# Altium schematic sheet SAMA7D65_PIO.SchDoc
size 420 x 297 mm; SheetNumber: 8; SheetTotal: 23
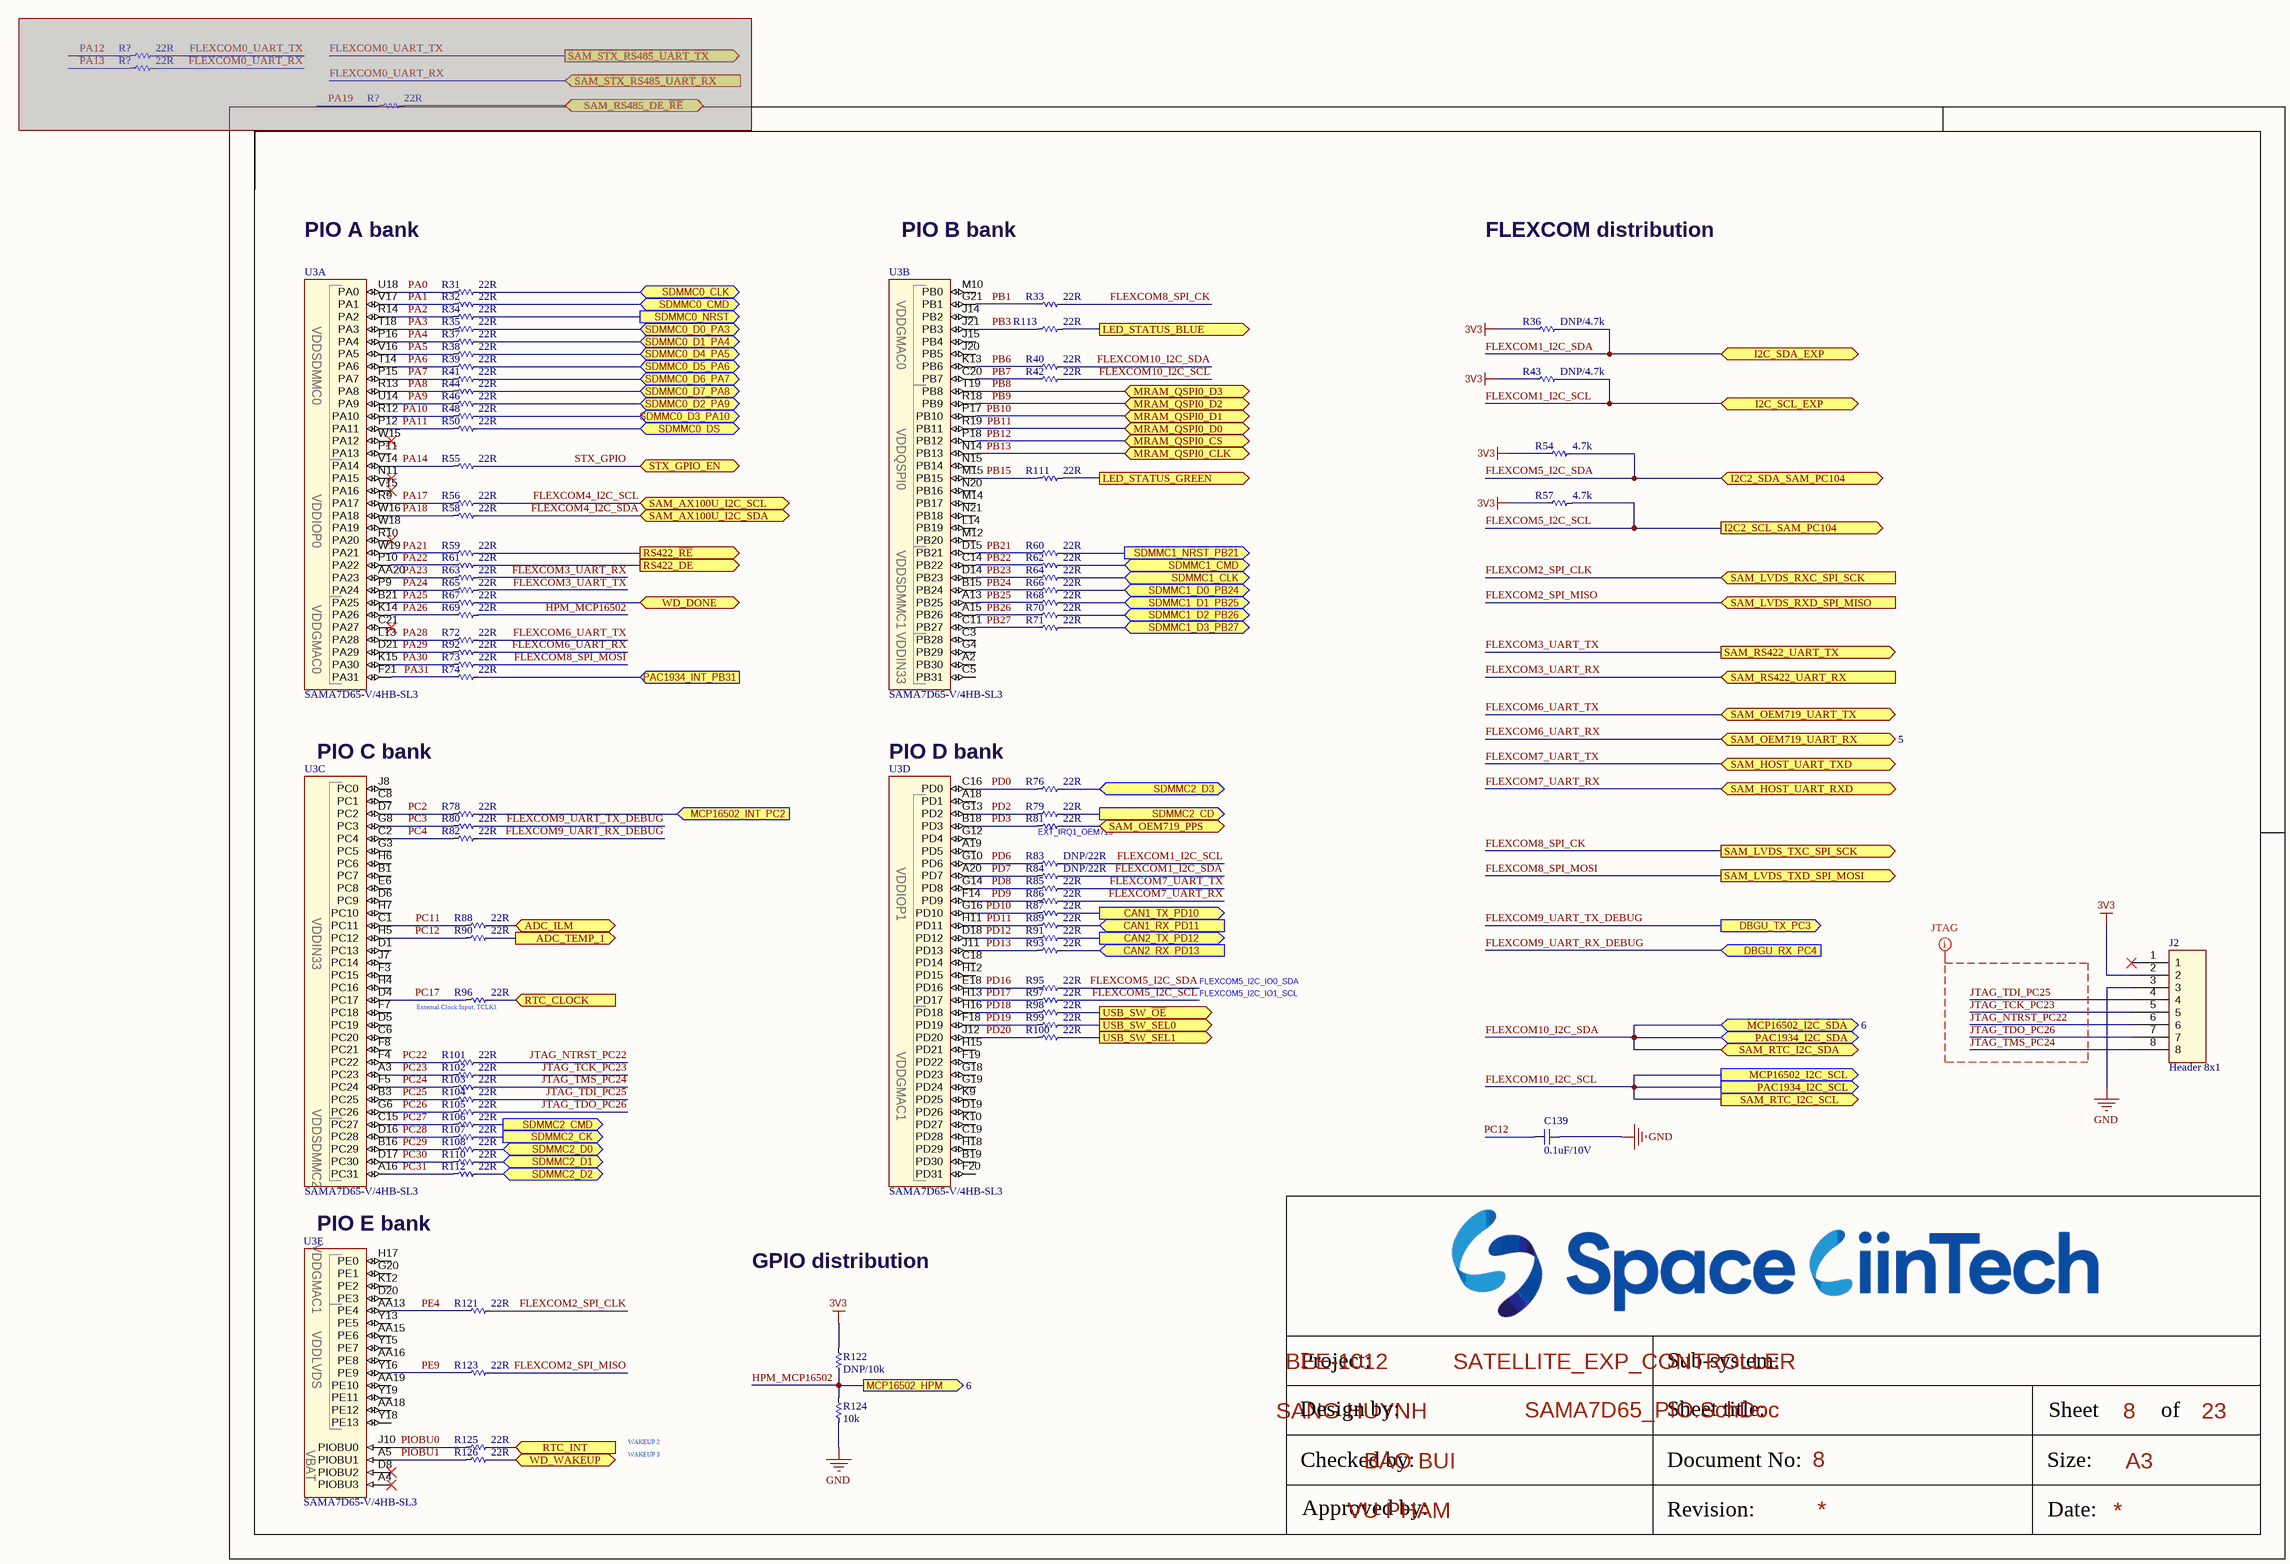
[diagram p0: SAMA7D65_PIO.SchDoc]

## Parts
(Parts that share a designator on the sheet are numbered #1, #2 ... from top to bottom, then left to right.)
C139  0.1uF/10V  [CAP_C_0603x30]
J2  Header 8x1  [Header_254P_8x1]
R31  22R  [RES_C_0603X30]
R32  22R  [RES_C_0603X30]
R33  22R  [RES_C_0603X30]
R34  22R  [RES_C_0603X30]
R35  22R  [RES_C_0603X30]
R36  DNP/4.7k  [RES_C_0603X30]
R37  22R  [RES_C_0603X30]
R38  22R  [RES_C_0603X30]
R39  22R  [RES_C_0603X30]
R40  22R  [RES_C_0603X30]
R41  22R  [RES_C_0603X30]
R42  22R  [RES_C_0603X30]
R43  DNP/4.7k  [RES_C_0603X30]
R44  22R  [RES_C_0603X30]
R46  22R  [RES_C_0603X30]
R48  22R  [RES_C_0603X30]
R50  22R  [RES_C_0603X30]
R54  4.7k  [RES_C_0603X30]
R55  22R  [RES_C_0603X30]
R56  22R  [RES_C_0603X30]
R57  4.7k  [RES_C_0603X30]
R58  22R  [RES_C_0603X30]
R59  22R  [RES_C_0603X30]
R60  22R  [RES_C_0603X30]
R61  22R  [RES_C_0603X30]
R62  22R  [RES_C_0603X30]
R63  22R  [RES_C_0603X30]
R64  22R  [RES_C_0603X30]
R65  22R  [RES_C_0603X30]
R66  22R  [RES_C_0603X30]
R67  22R  [RES_C_0603X30]
R68  22R  [RES_C_0603X30]
R69  22R  [RES_C_0603X30]
R70  22R  [RES_C_0603X30]
R71  22R  [RES_C_0603X30]
R72  22R  [RES_C_0603X30]
R73  22R  [RES_C_0603X30]
R74  22R  [RES_C_0603X30]
R76  22R  [RES_C_0603X30]
R78  22R  [RES_C_0603X30]
R79  22R  [RES_C_0603X30]
R80  22R  [RES_C_0603X30]
R81  22R  [RES_C_0603X30]
R82  22R  [RES_C_0603X30]
R83  DNP/22R  [RES_C_0603X30]
R84  DNP/22R  [RES_C_0603X30]
R85  22R  [RES_C_0603X30]
R86  22R  [RES_C_0603X30]
R87  22R  [RES_C_0603X30]
R88  22R  [RES_C_0603X30]
R89  22R  [RES_C_0603X30]
R90  22R  [RES_C_0603X30]
R91  22R  [RES_C_0603X30]
R92  22R  [RES_C_0603X30]
R93  22R  [RES_C_0603X30]
R95  22R  [RES_C_0603X30]
R96  22R  [RES_C_0603X30]
R97  22R  [RES_C_0603X30]
R98  22R  [RES_C_0603X30]
R99  22R  [RES_C_0603X30]
R100  22R  [RES_C_0603X30]
R101  22R  [RES_C_0603X30]
R102  22R  [RES_C_0603X30]
R103  22R  [RES_C_0603X30]
R104  22R  [RES_C_0603X30]
R105  22R  [RES_C_0603X30]
R106  22R  [RES_C_0603X30]
R107  22R  [RES_C_0603X30]
R108  22R  [RES_C_0603X30]
R110  22R  [RES_C_0603X30]
R111  22R  [RES_C_0603X30]
R112  22R  [RES_C_0603X30]
R113  22R  [RES_C_0603X30]
R121  22R  [RES_C_0603X30]
R122  DNP/10k  [RES_C_1005x30_L]
R123  22R  [RES_C_0603X30]
R124  10k  [RES_C_1005x30_L]
R125  22R  [RES_C_0603X30]
R126  22R  [RES_C_0603X30]
R?#1  22R  [RES_C_0603X30]  (masked out: inside a compile mask, not in the netlist)
R?#2  22R  [RES_C_0603X30]  (masked out: inside a compile mask, not in the netlist)
R?#3  22R  [RES_C_0603X30]  (masked out: inside a compile mask, not in the netlist)
U3  value SAMA7D65-V/4HB-SL3  [TFBGA-343_14x14]  (hidden comment: SAMA7D65)  (parts A,B,C,D,E of 8)

## Ports
ADC_ILM (bidir, see 3), ADC_TEMP_1 (out, see 15), CAN1_RX_PD11 (in, see 19), CAN1_TX_PD10 (out, see 19), CAN2_RX_PD13 (in, see 19), CAN2_TX_PD12 (out, see 19), DBGU_RX_PC4 (in, see 14), DBGU_TX_PC3 (out, see 14), I2C2_SCL_SAM_PC104 (out, see 5), I2C2_SDA_SAM_PC104 (bidir, see 5), I2C_SCL_EXP (bidir, see 4, 5), I2C_SDA_EXP (bidir, see 4, 5), LED_STATUS_BLUE (out, see 22), LED_STATUS_GREEN (out, see 22), MCP16502_HPM (out, see 6), MCP16502_I2C_SCL (out, see 6), MCP16502_I2C_SDA (bidir, see 6), MCP16502_INT_PC2 (in, see 6), MRAM_QSPI0_CLK (bidir, see 12), MRAM_QSPI0_CS (bidir, see 12), MRAM_QSPI0_D0 (bidir, see 12), MRAM_QSPI0_D1 (bidir, see 12), MRAM_QSPI0_D2 (bidir, see 12), MRAM_QSPI0_D3 (bidir, see 12), PAC1934_I2C_SCL (out, see 6), PAC1934_I2C_SDA (bidir, see 6), PAC1934_INT_PB31 (in, see 6), RS422_DE (out, see 21), RS422_~{RE} (out, see 21), RTC_CLOCK (in, see 16), RTC_INT (in, see 16), SAM_AX100U_I2C_SCL (bidir, see 5), SAM_AX100U_I2C_SDA (bidir, see 5), SAM_HOST_UART_RXD (bidir, see 5), SAM_HOST_UART_TXD (bidir, see 5), SAM_LVDS_RXC_SPI_SCK (in, see 18), SAM_LVDS_RXD_SPI_MISO (in, see 18), SAM_LVDS_TXC_SPI_SCK (out, see 18), SAM_LVDS_TXD_SPI_MOSI (out, see 18), SAM_OEM719_PPS (bidir, see 5), SAM_OEM719_UART_RX (bidir, see 5), SAM_OEM719_UART_TX (bidir, see 5), SAM_RS422_UART_RX (in, see 21), SAM_RS422_UART_TX (out, see 21), SAM_RS485_DE_~{RE} (bidir), SAM_RTC_I2C_SCL (out, see 16), SAM_RTC_I2C_SDA (bidir, see 16), SAM_STX_RS485_UART_RX (in), SAM_STX_RS485_UART_TX (out), SDMMC0_CLK (bidir, see 11), SDMMC0_CMD (bidir, see 11), SDMMC0_D0_PA3 (bidir, see 11), SDMMC0_D1_PA4 (bidir, see 11), SDMMC0_D2_PA9 (bidir, see 11), SDMMC0_D3_PA10 (bidir, see 11), SDMMC0_D4_PA5 (bidir, see 11), SDMMC0_D5_PA6 (bidir, see 11), SDMMC0_D6_PA7 (bidir, see 11), SDMMC0_D7_PA8 (bidir, see 11), SDMMC0_DS (bidir, see 11), SDMMC0_NRST (out, see 11), SDMMC1_CLK (bidir, see 11), SDMMC1_CMD (bidir, see 11), SDMMC1_D0_PB24 (bidir, see 11), SDMMC1_D1_PB25 (bidir, see 11), SDMMC1_D2_PB26 (bidir, see 11), SDMMC1_D3_PB27 (bidir, see 11), SDMMC1_NRST_PB21 (out, see 11), SDMMC2_CD (out, see 10), SDMMC2_CK (out, see 10), SDMMC2_CMD (out, see 10), SDMMC2_D0 (bidir, see 10), SDMMC2_D1 (bidir, see 10), SDMMC2_D2 (bidir, see 10), SDMMC2_D3 (bidir, see 10), STX_GPIO_EN (bidir, see 5), USB_SW_SEL0 (out, see 13), USB_SW_SEL1 (out, see 13), USB_SW_~{OE} (out, see 13), WD_DONE (bidir, see 17), WD_WAKEUP (bidir, see 17)

## Nets
3V3: J2.2 R36.1 R43.1 R54.1 R57.1 R122.1
GND: C139.1 J2.3 R124.2
ADC_ILM: R88.2 ; port ADC_ILM
ADC_TEMP_1: R90.2 ; port ADC_TEMP_1
CAN1_RX_PD11: R89.2 ; port CAN1_RX_PD11
CAN1_TX_PD10: R87.2 ; port CAN1_TX_PD10
CAN2_RX_PD13: R93.2 ; port CAN2_RX_PD13
CAN2_TX_PD12: R91.2 ; port CAN2_TX_PD12
FLEXCOM1_I2C_SCL: R43.2 R83.2 ; port I2C_SCL_EXP
FLEXCOM1_I2C_SDA: R36.2 R84.2 ; port I2C_SDA_EXP
FLEXCOM2_SPI_CLK: R121.2 ; port SAM_LVDS_RXC_SPI_SCK
FLEXCOM2_SPI_MISO: R123.2 ; port SAM_LVDS_RXD_SPI_MISO
FLEXCOM3_UART_RX: R63.2 ; port SAM_RS422_UART_RX
FLEXCOM3_UART_TX: R65.2 ; port SAM_RS422_UART_TX
FLEXCOM4_I2C_SCL: R56.2 ; port SAM_AX100U_I2C_SCL
FLEXCOM4_I2C_SDA: R58.2 ; port SAM_AX100U_I2C_SDA
FLEXCOM5_I2C_SCL: R57.2 R97.2 ; port I2C2_SCL_SAM_PC104
FLEXCOM5_I2C_SDA: R54.2 R95.2 ; port I2C2_SDA_SAM_PC104
FLEXCOM6_UART_RX: R92.2 ; port SAM_OEM719_UART_RX
FLEXCOM6_UART_TX: R72.2 ; port SAM_OEM719_UART_TX
FLEXCOM7_UART_RX: R86.2 ; port SAM_HOST_UART_RXD
FLEXCOM7_UART_TX: R85.2 ; port SAM_HOST_UART_TXD
FLEXCOM8_SPI_CK: R33.2 ; port SAM_LVDS_TXC_SPI_SCK
FLEXCOM8_SPI_MOSI: R73.2 ; port SAM_LVDS_TXD_SPI_MOSI
FLEXCOM9_UART_RX_DEBUG: R82.2 ; port DBGU_RX_PC4
FLEXCOM9_UART_TX_DEBUG: R80.2 ; port DBGU_TX_PC3
FLEXCOM10_I2C_SCL: R42.2 ; port MCP16502_I2C_SCL, port PAC1934_I2C_SCL, port SAM_RTC_I2C_SCL
FLEXCOM10_I2C_SDA: R40.2 ; port MCP16502_I2C_SDA, port PAC1934_I2C_SDA, port SAM_RTC_I2C_SDA
HPM_MCP16502: R69.2 R122.2 R124.1 ; port MCP16502_HPM
JTAG_NTRST_PC22: J2.6 R101.2
JTAG_TCK_PC23: J2.5 R102.2
JTAG_TDI_PC25: J2.4 R104.2
JTAG_TDO_PC26: J2.7 R105.2
JTAG_TMS_PC24: J2.8 R103.2
LED_STATUS_BLUE: R113.2 ; port LED_STATUS_BLUE
LED_STATUS_GREEN: R111.2 ; port LED_STATUS_GREEN
MCP16502_INT_PC2: R78.2 ; port MCP16502_INT_PC2
PA0: R31.1 U3.U18(PA0)
PA1: R32.1 U3.V17(PA1)
PA2: R34.1 U3.R14(PA2)
PA3: R35.1 U3.T18(PA3)
PA4: R37.1 U3.P16(PA4)
PA5: R38.1 U3.V16(PA5)
PA6: R39.1 U3.T14(PA6)
PA7: R41.1 U3.P15(PA7)
PA8: R44.1 U3.R13(PA8)
PA9: R46.1 U3.U14(PA9)
PA10: R48.1 U3.R12(PA10)
PA11: R50.1 U3.P12(PA11)
PA14: R55.1 U3.V14(PA14)
PA17: R56.1 U3.R9(PA17)
PA18: R58.1 U3.W16(PA18)
PA21: R59.1 U3.W19(PA21)
PA22: R61.1 U3.P10(PA22)
PA23: R63.1 U3.AA20(PA23)
PA24: R65.1 U3.P9(PA24)
PA25: R67.1 U3.B21(PA25)
PA26: R69.1 U3.K14(PA26)
PA28: R72.1 U3.L13(PA28)
PA29: R92.1 U3.D21(PA29)
PA30: R73.1 U3.K15(PA30)
PA31: R74.1 U3.F21(PA31)
PAC1934_INT_PB31: R74.2 ; port PAC1934_INT_PB31
PB1: R33.1 U3.G21(PB1)
PB3: R113.1 U3.J21(PB3)
PB6: R40.1 U3.K13(PB6)
PB7: R42.1 U3.C20(PB7)
PB8: U3.T19(PB8) ; port MRAM_QSPI0_D3
PB9: U3.R18(PB9) ; port MRAM_QSPI0_D2
PB10: U3.P17(PB10) ; port MRAM_QSPI0_D1
PB11: U3.R19(PB11) ; port MRAM_QSPI0_D0
PB12: U3.P18(PB12) ; port MRAM_QSPI0_CS
PB13: U3.N14(PB13) ; port MRAM_QSPI0_CLK
PB15: R111.1 U3.M15(PB15)
PB21: R60.1 U3.D15(PB21)
PB22: R62.1 U3.C14(PB22)
PB23: R64.1 U3.D14(PB23)
PB24: R66.1 U3.B15(PB24)
PB25: R68.1 U3.A13(PB25)
PB26: R70.1 U3.A15(PB26)
PB27: R71.1 U3.C11(PB27)
PC2: R78.1 U3.D7(PC2)
PC3: R80.1 U3.G8(PC3)
PC4: R82.1 U3.C2(PC4)
PC11: R88.1 U3.C1(PC11)
PC12: C139.2 R90.1 U3.H5(PC12)
PC17: R96.1 U3.D4(PC17)
PC22: R101.1 U3.F4(PC22)
PC23: R102.1 U3.A3(PC23)
PC24: R103.1 U3.F5(PC24)
PC25: R104.1 U3.B3(PC25)
PC26: R105.1 U3.G6(PC26)
PC27: R106.1 U3.C15(PC27)
PC28: R107.1 U3.D16(PC28)
PC29: R108.1 U3.B16(PC29)
PC30: R110.1 U3.D17(PC30)
PC31: R112.1 U3.A16(PC31)
PD0: R76.1 U3.C16(PD0)
PD2: R79.1 U3.G13(PD2)
PD3: R81.1 U3.B18(PD3)
PD6: R83.1 U3.G10(PD6)
PD7: R84.1 U3.A20(PD7)
PD8: R85.1 U3.G14(PD8)
PD9: R86.1 U3.F14(PD9)
PD10: R87.1 U3.G16(PD10)
PD11: R89.1 U3.H11(PD11)
PD12: R91.1 U3.D18(PD12)
PD13: R93.1 U3.J11(PD13)
PD16: R95.1 U3.E18(PD16)
PD17: R97.1 U3.H13(PD17)
PD18: R98.1 U3.H16(PD18)
PD19: R99.1 U3.F18(PD19)
PD20: R100.1 U3.J12(PD20)
PE4: R121.1 U3.AA13(PE4)
PE9: R123.1 U3.Y16(PE9)
PIOBU0: R125.1 U3.J10(PIOBU0)
PIOBU1: R126.1 U3.A5(PIOBU1)
RS422_DE: R61.2 ; port RS422_DE
RS422_~{RE}: R59.2 ; port RS422_~{RE}
RTC_CLOCK: R96.2 ; port RTC_CLOCK
RTC_INT: R125.2 ; port RTC_INT
SAM_OEM719_PPS: R81.2 ; port SAM_OEM719_PPS
SDMMC0_CLK: R31.2 ; port SDMMC0_CLK
SDMMC0_CMD: R32.2 ; port SDMMC0_CMD
SDMMC0_D0_PA3: R35.2 ; port SDMMC0_D0_PA3
SDMMC0_D1_PA4: R37.2 ; port SDMMC0_D1_PA4
SDMMC0_D2_PA9: R46.2 ; port SDMMC0_D2_PA9
SDMMC0_D3_PA10: R48.2 ; port SDMMC0_D3_PA10
SDMMC0_D4_PA5: R38.2 ; port SDMMC0_D4_PA5
SDMMC0_D5_PA6: R39.2 ; port SDMMC0_D5_PA6
SDMMC0_D6_PA7: R41.2 ; port SDMMC0_D6_PA7
SDMMC0_D7_PA8: R44.2 ; port SDMMC0_D7_PA8
SDMMC0_DS: R50.2 ; port SDMMC0_DS
SDMMC0_NRST: R34.2 ; port SDMMC0_NRST
SDMMC1_CLK: R64.2 ; port SDMMC1_CLK
SDMMC1_CMD: R62.2 ; port SDMMC1_CMD
SDMMC1_D0_PB24: R66.2 ; port SDMMC1_D0_PB24
SDMMC1_D1_PB25: R68.2 ; port SDMMC1_D1_PB25
SDMMC1_D2_PB26: R70.2 ; port SDMMC1_D2_PB26
SDMMC1_D3_PB27: R71.2 ; port SDMMC1_D3_PB27
SDMMC1_NRST_PB21: R60.2 ; port SDMMC1_NRST_PB21
SDMMC2_CD: R79.2 ; port SDMMC2_CD
SDMMC2_CK: R107.2 ; port SDMMC2_CK
SDMMC2_CMD: R106.2 ; port SDMMC2_CMD
SDMMC2_D0: R108.2 ; port SDMMC2_D0
SDMMC2_D1: R110.2 ; port SDMMC2_D1
SDMMC2_D2: R112.2 ; port SDMMC2_D2
SDMMC2_D3: R76.2 ; port SDMMC2_D3
STX_GPIO: R55.2 ; port STX_GPIO_EN
USB_SW_~{OE}: R98.2 ; port USB_SW_~{OE}
USB_SW_SEL0: R99.2 ; port USB_SW_SEL0
USB_SW_SEL1: R100.2 ; port USB_SW_SEL1
WD_DONE: R67.2 ; port WD_DONE
WD_WAKEUP: R126.2 ; port WD_WAKEUP

Not connected (* = marked no-connect by the designer): J2 1*; U3 A2(PB30) A4(PIOBU3)* A18(PD1) A19(PD5) AA15(PE6) AA16(PE8) AA18(PE12) AA19(PE10) B1(PC7) B19(PD30) C3(PB28) C5(PB31) C6(PC20) C8(PC1) C18(PD14) C19(PD28) C21(PA27)* D1(PC13) D5(PC19) D6(PC9) D8(PIOBU2)* D19(PD26) D20(PE3) E6(PC8) F3(PC15) F7(PC18) F8(PC21) F19(PD22) F20(PD31) G3(PC5) G4(PB29) G12(PD4) G18(PD23) G19(PD24) G20(PE1) H4(PC16) H6(PC6) H7(PC10) H12(PD15) H15(PD21) H17(PE0) H18(PD29) J7(PC14) J8(PC0) J14(PB2) J15(PB4) J20(PB5) K9(PD25) K10(PD27) K12(PE2) L14(PB19) M10(PB0) M12(PB20) M14(PB17) N11(PA15)* N15(PB14) N20(PB16) N21(PB18) P11(PA13) R10(PA20)* V15(PA16)* W15(PA12)* W18(PA19) Y13(PE5) Y15(PE7) Y18(PE13) Y19(PE11)

## Layout directives
net class JTAG; rule Matched Net Lengths [Tolerance = 2mm]: JTAG_NTRST_PC22, JTAG_TCK_PC23, JTAG_TDI_PC25, JTAG_TDO_PC26, JTAG_TMS_PC24

## Notes on the sheet
- PIO A bank
- PIO B bank
- FLEXCOM distribution
- (near U3) PIO C bank
- (near U3) PIO D bank
- (near R81) EXT_IRQ1_OEM719
- (near R96) External Clock Input, TCLK1
- FLEXCOM5_I2C_IO0_SDA
- FLEXCOM5_I2C_IO1_SCL
- (near U3) PIO E bank
- GPIO distribution
- WAKEUP 2
- WAKEUP 3
- Project:
- BEE-1012
- Sub-system:
- SATELLITE_EXP_CONTROLLER
- Design by:
- SANG HUYNH
- BAO BUI
- Sheet title:
- Sheet
- A3
- of
- Checked by:
- Approved by:
- VU PHAM
- Revision:
- Document No:
- Size:
- Date:

## Library data of the parts
C139 = _CAP_C_2: CAP CHIP
R31-R44 R46 R48 R50 R54-R74 R76 R78-R93 R95-R108 R110-R113 R121-R126 R?#1-R?#3 = _RES_B_2: RES
U3 = SAMA7D65: SAMA7D65 MPU 1000MHz Cortex-A7 TFBGA-343; Manufacturer 1: Microchip Technology; Description_: MCHP MPU 32-BIT Cortex-A7 1000MHz 128kB SAMA7D65-V/4HB-SL3 TFBGA-343; Populated: YES; MCHP-ID: IC2674; Symbol: SAMA7D65-TFBGA-343; Dev Tools Status: Design; Owner: Ciprian Abramov; Restricted Sourcing: No; Manufacturer Part Number 1: SAMA7D65-V/4HB-SL3; Type: 32-Bit MPU; Status: MCL Design; Revision: 1; Category: MCHP-Microcontroller; ComponentLink1URL: https://www.microchip.com/sitesearch/search/Product%20and%20Development%20Tools/SAMA7D65-V/4HB-SL3; ComponentLink1Description: SVN Datasheet; ComponentLink2Description: Local Datasheet; ComponentLink3URL: C:\ALTIUM_WORK\00001_MCHP-CDB\Library\LibraryRefs\SAMA7D65-TFBGA-343.SchLib; ComponentLink3Description: Open Symbol; ComponentLink4URL: C:\ALTIUM_WORK\00001_MCHP-CDB\Library\Footprints\TFBGA-343_14x14.PcbLib; ComponentLink4Description: Open Footprint; ComponentLink5Description: Open Footprint 2; ComponentLink6Description: Open Footprint 3; ComponentLink7Description: Open Footprint 4; Supplier 1: Microchip Technology; Supplier Part Number 1: SAMA7D65-V/4HB-SL3; Operating Temperature: -40C to +105C; Quantity Override: 1